# EAGLE schematic H38R01 (EAGLE 9.6.2)
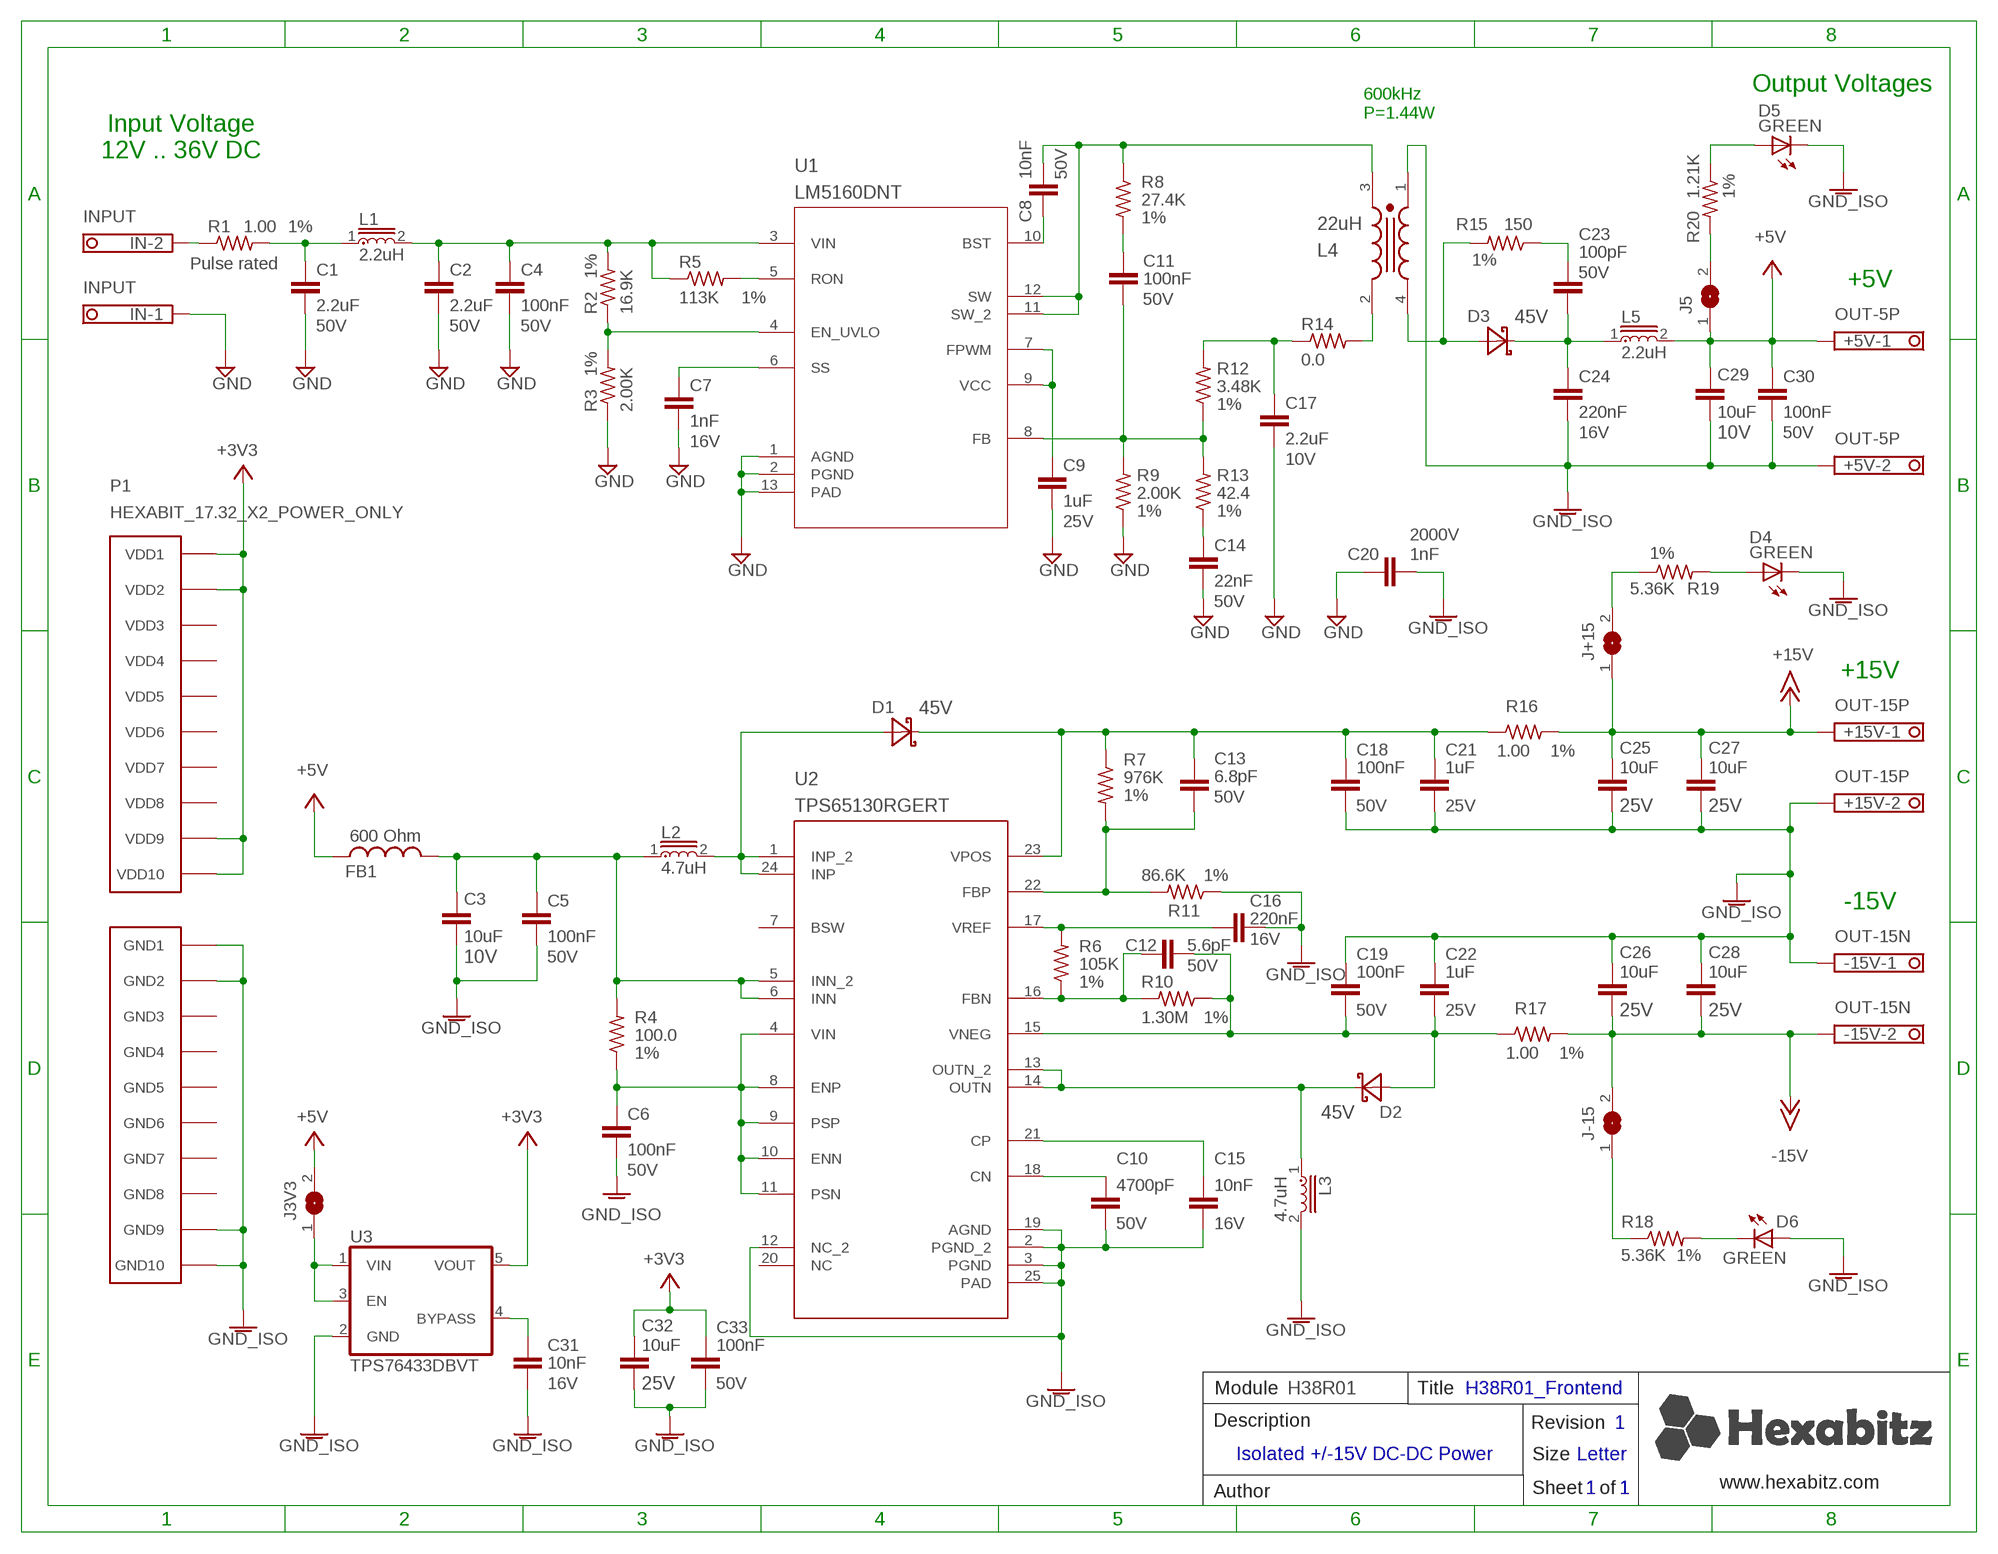
[diagram p0: schematic, sheet 1]

## Parts
+5V  OUT-5P  CON-PHOENIX-350_1751248  [CON-PHOENIX-350_1751248]
+15V  OUT-15P  CON-PHOENIX-350_1751248  [CON-PHOENIX-350_1751248]
-15V  OUT-15N  CON-PHOENIX-350_1751248  [CON-PHOENIX-350_1751248]
C1  2.2uF  C-1206  [C1206K]
C2  2.2uF  C-1206  [C1206K]
C3  10uF  C-0805  [C-0805]
C4  100nF  C-0603  [C-0603]
C5  100nF  C-0603  [C-0603]
C6  100nF  C-0603  [C-0603]
C7  1nF  C-0603  [C-0603]
C8  10nF  C-0603  [C-0603]
C9  1uF  C-0603  [C-0603]
C10  4700pF  C-0603  [C-0603]
C11  100nF  C-0603  [C-0603]
C12  5.6pF  C-0603  [C-0603]
C13  6.8pF  C-0603  [C-0603]
C14  22nF  C-0603  [C-0603]
C15  10nF  C-0603  [C-0603]
C16  220nF  C-0603  [C-0603]
C17  2.2uF  C-0603  [C-0603]
C18  100nF  C-0603  [C-0603]
C19  100nF  C-0603  [C-0603]
C20  1nF  C-1206  [C1206K]
C21  1uF  C-0603  [C-0603]
C22  1uF  C-0603  [C-0603]
C23  100pF  C-0603  [C-0603]
C24  220nF  C-0603  [C-0603]
C25  10uF  C-0805  [C-0805]
C26  10uF  C-0805  [C-0805]
C27  10uF  C-0805  [C-0805]
C28  10uF  C-0805  [C-0805]
C29  10uF  C-0805  [C-0805]
C30  100nF  C-0603  [C-0603]
C31  10nF  C-0603  [C-0603]
C32  10uF  C-0805  [C-0805]
C33  100nF  C-0603  [C-0603]
D1  DIOD-SOD-123  [SOD123]
D2  DIOD-SOD-123  [SOD123]
D3  DIOD-SOD-123  [SOD123]
D4  GREEN  VLMTG1300-GS08  [VLMS1300-GS08]
D5  GREEN  VLMTG1300-GS08  [VLMS1300-GS08]
D6  GREEN  VLMTG1300-GS08  [VLMS1300-GS08]
FB1  600 Ohm  FB-0603  [FB-0603]
IN  INPUT  CON-PHOENIX-350_1751248  [CON-PHOENIX-350_1751248]
J3V3  SJ  [SJ]
J5  SJ  [SJ]
J+15  SJ  [SJ]
J-15  SJ  [SJ]
L1  2.2uH  LQM18PN2R2MFHD  [C-0603]
L2  4.7uH  WUERTH_ELEKTRONIK_74404024100WUERTH_ELEKTRONIK_74404024100_0_0  [WUERTH_ELEKTRONIK_74404024100_0]
L3  4.7uH  WUERTH_ELEKTRONIK_74404024100WUERTH_ELEKTRONIK_74404024100_0_0  [WUERTH_ELEKTRONIK_74404024100_0]
L4  22uH  WUERTH_ELEKTRONIK_74489430220WUERTH_ELEKTRONIK_74489430220_0_0  [WUERTH_ELEKTRONIK_74489430220_0]
L5  2.2uH  LQM18PN2R2MFHD  [C-0603]
P1  HEXABIT_17.32_X2_POWER_ONLY  [HEXABIT_17.32_X2_POWER_ONLY]
R1  1.00  R-0603  [R-0603]
R2  16.9K  R-0603  [R-0603]
R3  2.00K  R-0603  [R-0603]
R4  100.0  R-0603  [R-0603]
R5  113K  R-0603  [R-0603]
R6  105K  R-0603  [R-0603]
R7  976K  R-0603  [R-0603]
R8  27.4K  R-0603  [R-0603]
R9  2.00K  R-0603  [R-0603]
R10  1.30M  R-0603  [R-0603]
R11  86.6K  R-0603  [R-0603]
R12  3.48K  R-0603  [R-0603]
R13  42.4  R-0603  [R-0603]
R14  0.0  R-0603  [R-0603]
R15  150  R-0603  [R-0603]
R16  1.00  R-0603  [R-0603]
R17  1.00  R-0603  [R-0603]
R18  5.36K  R-0603  [R-0603]
R19  5.36K  R-0603  [R-0603]
R20  1.21K  R-0603  [R-0603]
U1  LM5160DNT  [DNT0012B]
U2  TPS65130RGERT  [RGE0024B_NV]
U3  TPS76433DBVT  [SOT25]

## Nets
+3V3: C32.1 C33.1 P1.PAD_PU11(VDD1) P1.PAD_PU12(VDD2) P1.PAD_PU19(VDD9) P1.PAD_PU20(VDD10) U3.5(VOUT)
+5V: +5V.1 C29.1 C30.1 FB1.1 J3V3.2 J5.1 L5.2
+15V: +15V.1 C25.1 C27.1 J+15.1 R16.2
-15V: -15V.2 C26.2 C28.2 J-15.2 R17.2
GND: C1.2 C2.2 C4.2 C7.2 C9.2 C14.2 C17.2 C20.1 IN.1 R3.1 R9.1 U1.1(AGND) U1.2(PGND) U1.13(PAD)
IGND: +5V.2 +15V.2 -15V.1 C3.2 C5.2 C6.2 C10.2 C15.2 C16.2 C18.2 C19.1 C20.2 C21.2 C22.1 C24.2 C25.2 C26.1 C27.2 C28.1 C29.2 C30.2 C31.2 C32.2 C33.2 D4.C D5.C D6.A L3.2 L4.1 P1.PAD_PD11(GND1) P1.PAD_PD12(GND2) P1.PAD_PD19(GND9) P1.PAD_PD20(GND10) R11.1 U2.2(PGND_2) U2.3(PGND) U2.12(NC_2) U2.19(AGND) U2.25(PAD) U3.2(GND) ; supply symbol labelled GND_ISO
N$1: IN.2 R1.1
N$2: C1.1 L1.1 R1.2
N$3: C2.1 C4.1 L1.2 R2.2 R5.1 U1.3(VIN)
N$4: R5.2 U1.5(RON)
N$5: R2.1 R3.2 U1.4(EN_UVLO)
N$6: C7.1 U1.6(SS)
N$7: C8.2 L4.3 R8.1 U1.11(SW_2) U1.12(SW)
N$8: C8.1 U1.10(BST)
N$9: C9.1 U1.7(FPWM) U1.9(VCC)
N$10: C11.2 R9.2 R12.1 R13.2 U1.8(FB)
N$11: C11.1 R8.2
N$12: C17.1 R12.2 R14.1
N$13: L4.2 R14.2
N$14: C14.1 R13.1
N$15: C23.2 C24.1 D3.2(C) L5.1
N$16: D3.1(A) L4.4 R15.2
N$17: C23.1 R15.1
N$18: C3.1 C5.1 FB1.2 L2.1 R4.2 U2.5(INN_2) U2.6(INN)
N$19: J5.2 R20.2
N$20: D5.A R20.1
N$21: D1.1(A) L2.2 U2.1(INP_2) U2.24(INP)
N$22: C13.2 C18.1 C21.1 D1.2(C) R7.1 R16.1 U2.23(VPOS)
N$23: C6.1 R4.1 U2.4(VIN) U2.8(ENP) U2.9(PSP) U2.10(ENN) U2.11(PSN)
N$24: C10.1 U2.18(CN)
N$25: C15.1 U2.21(CP)
N$26: D2.2(C) L3.1 U2.13(OUTN_2) U2.14(OUTN)
N$27: C12.2 C19.2 C22.2 D2.1(A) R10.1 R17.1 U2.15(VNEG)
N$28: C12.1 R6.1 R10.2 U2.16(FBN)
N$29: C16.1 R6.2 U2.17(VREF)
N$30: C13.1 R7.2 R11.2 U2.22(FBP)
N$31: J+15.2 R19.1
N$32: D4.A R19.2
N$33: J-15.1 R18.1
N$34: D6.C R18.2
N$35: C31.1 U3.4(BYPASS)
N$36: J3V3.1 U3.1(VIN) U3.3(EN)
Unconnected: U2.7(BSW) U2.20(NC)

## Notes on the sheet
- Output Voltages
- 600kHz
  P=1.44W
- Input Voltage
  12V .. 36V DC
- Pulse rated
- +5V
- +15V
- -15V
- Module | H38R01 | Title | H38R01_Frontend
- Description | Revision | 1
- Isolated +/-15V DC-DC Power
- Size | Letter
- www.hexabitz.com
- Author | Sheet   of | 1 | 1
- C:/Users/Admin/Desktop/logodraft.bmp

## Power pins joined to a net without a drawn wire
GND3: P1.PAD_PD13(GND3)
GND4: P1.PAD_PD14(GND4)
GND5: P1.PAD_PD15(GND5)
GND6: P1.PAD_PD16(GND6)
GND7: P1.PAD_PD17(GND7)
GND8: P1.PAD_PD18(GND8)
VDD3: P1.PAD_PU13(VDD3)
VDD4: P1.PAD_PU14(VDD4)
VDD5: P1.PAD_PU15(VDD5)
VDD6: P1.PAD_PU16(VDD6)
VDD7: P1.PAD_PU17(VDD7)
VDD8: P1.PAD_PU18(VDD8)

## Library data of the parts
+5V +15V -15V IN = Hexabitz:CON-PHOENIX-350_1751248: 2pin Terminal Block; Printed Circuit; 10 A; 160 V; 3.5 mm; 2; 3.5 mm; 1.2 mm; M2; PA; MFN: Phoenix Contact; MPN: 1751251; OCTOPART_URL: https://octopart.com/1751251-phoenix+contact-36473?r=sp&s=9M0VWNoHTyq04j3qI6lQOQ; OC_FARNELL: unknown; OC_NEWARK: unknown
C1 C2 = Hexabitz:C-1206: Cap Tant Solid SMD 1206; CAPACITANCE: 2.2uF; MFN: Taiyo Yuden; MPN: UMK316B7225KD-T; OCTOPART_URL: https://octopart.com/umk316b7225kd-t-taiyo+yuden-22313261?r=sp&s=B2pE5EchQ-uXrqiEc-TSGg; VOLTAGE: 50V
C3 C29 = Hexabitz:C-0805: CAP CER 10% X7R 0805; CAPACITANCE: 10uF; MFN: Würth Elektronik; MPN: 885012207026; OCTOPART_URL: https://octopart.com/885012207026-w%C3%BCrth+elektronik-65419800?r=sp&s=PJ8-ZxRrRL-RXf1D2e7V7w; TOLERANCE: 10%; VOLTAGE_RATING: 10V
C4-C6 C11 C18 C19 C30 C33 = Hexabitz:C-0603: CAP CER 10% X7R 0603; CAPACITANCE: 100nF; MFN: TDK; MPN: C1608X7R1H104K; OCTOPART_URL: https://octopart.com/c1608x7r1h104k080aa-tdk-25947665?r=sp&s=vJ3_28x5RGekN18MBHqpKw; TOLERANCE: 10%; VOLTAGE_RATING: 50V
C7 = Hexabitz:C-0603: CAP CER 10% X7R 0603; CAPACITANCE: 1nF; MFN: Würth Elektronik; MPN: 885012206034; OCTOPART_URL: https://octopart.com/885012206034-w%C3%BCrth+elektronik-53914743?r=sp&s=3y92xzxLSKK6IudBxcGU8w; TOLERANCE: 10%; VOLTAGE_RATING: 16V
C8 = Hexabitz:C-0603: CAP CER 10% X7R 0603; CAPACITANCE: 10nF; MFN: KEMET; MPN: C0603C103J5RACTU; OCTOPART_URL: https://octopart.com/c0603c103j5ractu-kemet-91371?r=sp&s=Kyc2xDn-SuWGmNLJldLSIQ; TOLERANCE: 10%; VOLTAGE_RATING: 50V
C9 C21 C22 = Hexabitz:C-0603: CAP CER 10% X7R 0603; CAPACITANCE: 1uF; MFN: Taiyo Yuden; MPN: TMK107B7105KA-T; OCTOPART_URL: https://octopart.com/tmk107b7105ka-t-taiyo+yuden-20363789?r=sp&s=C0MvDSixSxq0oU7K_M5ppQ; TOLERANCE: 10%; VOLTAGE_RATING: 25V
C10 = Hexabitz:C-0603: CAP CER 10% X7R 0603; CAPACITANCE: 4700pF; MFN: Würth Elektronik; MPN: 885012206087; OCTOPART_URL: https://octopart.com/885012206087-w%C3%BCrth+elektronik-53914796?r=sp&s=1K2nhhCgSUq-KN0bvB69Uw; TOLERANCE: 10%; VOLTAGE_RATING: 50V
C12 = Hexabitz:C-0603: CAP CER 10% X7R 0603; CAPACITANCE: 5.6pF; MFN: TDK; MPN: 06035A5R6CAT2A; OCTOPART_URL: https://octopart.com/06035a5r6cat2a-avx-194782?r=sp&s=arSRmqwrS2KePu_erVaGmg; TOLERANCE: 5%; VOLTAGE_RATING: 50V
C13 = Hexabitz:C-0603: CAP CER 10% X7R 0603; CAPACITANCE: 6.8pF; MFN: AVX; MPN: 06035A6R8CAT2A; OCTOPART_URL: https://octopart.com/06035a6r8cat2a-avx-194783?r=sp&s=5-5NBtM6RDWLTSW9K30eVg; TOLERANCE: 10%; VOLTAGE_RATING: 50V
C14 = Hexabitz:C-0603: CAP CER 10% X7R 0603; CAPACITANCE: 22nF; MFN: Murata; MPN: GRM188R71H223KA01D; OCTOPART_URL: https://octopart.com/grm188r71h223ka01d-murata-196232?r=sp&s=t23e6pi9S5yo9EHFMT_EKg; TOLERANCE: 10%; VOLTAGE_RATING: 50V
C15 C31 = Hexabitz:C-0603: CAP CER 10% X7R 0603; CAPACITANCE: 10nF; MFN: Würth Elektronik; MPN: 885012206040; OCTOPART_URL: https://octopart.com/885012206040-w%C3%BCrth+elektronik-53914749?r=sp&s=G3_ezLbARM2-FohtMFECqg; TOLERANCE: 10%; VOLTAGE_RATING: 16V
C16 C24 = Hexabitz:C-0603: CAP CER 10% X7R 0603; CAPACITANCE: 220nF; MFN: Würth Elektronik; MPN: 885012206048; OCTOPART_URL: https://octopart.com/885012206048-w%C3%BCrth+elektronik-53914757?r=sp&s=r2jVh1M7TTWSNtdrsMd35A; TOLERANCE: 10%; VOLTAGE_RATING: 16V
C17 = Hexabitz:C-0603: CAP CER 10% X7R 0603; CAPACITANCE: 2.2uF; MFN: Murata; MPN: GRM188R71A225KE15D; OCTOPART_URL: https://octopart.com/grm188r71a225ke15d-murata-197889?r=sp&s=UhC5vs9xSQGkDEPPXrg6Ig; TOLERANCE: 10%; VOLTAGE_RATING: 10V
C20 = Hexabitz:C-1206: Cap Tant Solid SMD 1206; CAPACITANCE: 1nF; MFN: Johanson; MPN: 202R18W102KV4E; OCTOPART_URL: https://octopart.com/202r18w102kv4e-johanson-2172376?r=sp&s=IMqDAiaaSSy_LnEOeR4maQ; VOLTAGE: 2000V
C23 = Hexabitz:C-0603: CAP CER 10% X7R 0603; CAPACITANCE: 100pF; MFN: KEMET; MPN: C0603C101J5GACTU; OCTOPART_URL: https://octopart.com/c0603c101j5gactu-kemet-100052?r=sp&s=G9Wafbc2Rs-t41DcITu08w; TOLERANCE: 5%; VOLTAGE_RATING: 50V
C25-C28 C32 = Hexabitz:C-0805: CAP CER 10% X7R 0805; CAPACITANCE: 10uF; MFN: Murata; MPN: GRM21BC71E106KE11L; OCTOPART_URL: https://octopart.com/grm21bc71e106ke11l-murata-51454492?r=sp&s=2Vde2RpCRyqy5YYMvYke3Q; TOLERANCE: 10%; VOLTAGE_RATING: 25V
D1-D3 = Hexabitz:DIOD-SOD-123: 1.0 A Surface Mount Schottky Barrier Rectifier, 40 V, -65 to 125 degC, 2-Pin SOD-123 Package, RoHS, Tape and Reel; CURRENT: 2A; MFN: ON Semiconductor; MPN: NTS245SFT1G; OCTOPART_URL: https://octopart.com/nts245sft1g-on+semiconductor-53638116?r=sp&s=Zo8Z59f0QcynsgZ2PtBRwg; VOLTAGE_RATING_DC: 45V
D4-D6 = Hexabitz:VLMTG1300-GS08: LED Uni-Color Green 530nm 2-Pin Chip 0603(1608Metric) T/R; MFN: Vishay; MPN: VLMTG1300-GS08; OCTOPART_URL: https://octopart.com/vlmtg1300-gs08-vishay-21709202
FB1 = Hexabitz:FB-0603: Ferrite Beads Multi-Layer 0603; MFN: Murata; MPN: BLM18KG601SN1D; OCTOPART_URL: https://octopart.com/blm18kg601sn1d-murata-12276433?r=sp&s=hc41AUOpRWisdZqqWWZOxA
J3V3 J5 J+15 J-15 = jumper:SJ: SMD solder JUMPER
L1 L5 = Hexabitz:LQM18PN2R2MFHD: Inductor Power Chip Shielded Multi-Layer 2.2uH 20% 1MHz Ferrite 0.7A 0.475Ohm DCR 0603 T/R; MFN: Murata; MPN: LQM18PN2R2MFHD; OCTOPART_URL: https://octopart.com/lqm18pn2r2mfhd-murata-46921411?r=sp&s=Row_twtqSIqtu2tUWXcF8g#
L2 L3 = Hexabitz:WUERTH_ELEKTRONIK_74404024100: Inductor, Wirewound, Ferrite, 10 μH, 0.47 A, 0.435 ohm, SMD; CIIVA_IDS: 19365520; COMPONENT_LINK_1_DESCRIPTION: Manufacturer URL; COMPONENT_LINK_1_URL: http://www.we-online.com; DATASHEET: http://katalog.we-online.de/pbs/datasheet/74404024100.pdf; FOOTPRINT_VARIANT_NAME_0: Manufacturer Recommended; IMPORTED: yes; IMPORTED_FROM: vault; IMPORT_TS: 1521847971; INDUCTANCE: 4.7μH; MF: Wuerth Elektronik; MFN: Wuerth Elektronik; MPN: 74404024047; OCTOPART_URL: https://octopart.com/74404024047-w%C3%BCrth+elektronik-46948230?r=sp; PACKAGE: WE-LQS 252012; PREFIX: L; RELEASE_DATE: 1421136684; VALUE: 10uH; VAULT_GUID: 14C676CA-5921-489C-B22D-D02530F94C47; VAULT_REVISION: 1C5BE5AF-1DED-48F4-87F1-C018B46CE48A
L4 = Hexabitz:WUERTH_ELEKTRONIK_74489430220: Coupled inductor, 22 μH, 1.1 A, 0.48 ohm, SMD; CIIVA_IDS: 906613; COMPONENT_LINK_1_DESCRIPTION: Manufacturer URL; COMPONENT_LINK_1_URL: http://www.we-online.com; DATASHEET: http://katalog.we-online.de/pbs/datasheet/74489430220.pdf; FOOTPRINT_VARIANT_NAME_0: Manufacturer Recommended; IMPORTED: yes; IMPORTED_FROM: vault; IMPORT_TS: 1521847487; INDUCTANCE: 22.0 ÂμH; MF: Wuerth Elektronik; MFN: Wuerth Elektronik; MPN: 74489430220; OCTOPART_URL: https://octopart.com/74489430220-w%C3%BCrth+elektronik-19122490?r=sp&s=sZgvZhVdRiOvXPP3ZHNQng#; PACKAGE: WE-TDC 8018; PREFIX: L; RELEASE_DATE: 1421213019; VAULT_GUID: DC7281E7-2FA0-48B8-8A08-9B1522AF1AC9; VAULT_REVISION: AD34EA21-00F0-458B-A44F-F680A14C5CDA
P1 = hexabitz_connectors:HEXABIT_?_X2_POWER_ONLY: Hexabitz Double Hexagon Power-Only Module Connector Hexagon side length = 17.32mm.
R1 = Hexabitz:R-0603: Thick Film Resistors - SMD 0603; MFN: Vishay; MPN: RCS06031R00FKEA; OCTOPART_URL: https://octopart.com/rcs06031r00fkea-vishay-75198106?r=sp; RESISTANCE: 1.00; TOLERANCE: 1%
R2 = Hexabitz:R-0603: Thick Film Resistors - SMD 0603; MFN: Vishay; MPN: CRCW060316K9FKEA; OCTOPART_URL: https://octopart.com/crcw060316k9fkea-vishay-39809405?r=sp&s=gpyoC5sESS275Bx1L_ovfA; RESISTANCE: 16.9K; TOLERANCE: 1%
R3 R9 = Hexabitz:R-0603: Thick Film Resistors - SMD 0603; MFN: Vishay; MPN: CRCW06032K00FKEA; OCTOPART_URL: https://octopart.com/crcw06032k00fkea-vishay-39455515?r=sp&s=oLMBsKnqSyiGxb37P4YGRQ; RESISTANCE: 2.00k; TOLERANCE: 1%
R4 = Hexabitz:R-0603: Thick Film Resistors - SMD 0603; MFN: Vishay; MPN: CRCW0603100RFKEA; OCTOPART_URL: https://octopart.com/crcw0603100rfkea-vishay-39454046?r=sp&s=ZCLXy-8WTNaYdj0NMUzO0A; RESISTANCE: 100.0; TOLERANCE: 1%
R5 = Hexabitz:R-0603: Thick Film Resistors - SMD 0603; MFN: Vishay; MPN: CRCW0603113KFKEA; OCTOPART_URL: https://octopart.com/crcw0603113kfkea-vishay-39817257?r=sp&s=CTaWAi24RJSm7_6d5HDAcw; RESISTANCE: 113K; TOLERANCE: 1%
R6 = Hexabitz:R-0603: Thick Film Resistors - SMD 0603; MFN: Vishay; MPN: CRCW0603105KFKEA; OCTOPART_URL: https://octopart.com/crcw0603105kfkea-vishay-39783419?r=sp&s=m57LqOW9SZi8auMTWgZAuA; RESISTANCE: 105K; TOLERANCE: 1%
R7 = Hexabitz:R-0603: Thick Film Resistors - SMD 0603; MFN: Vishay; MPN: CRCW0603976KFKEA; OCTOPART_URL: https://octopart.com/crcw0603976kfkea-vishay-39847458?r=sp&s=cUxC9lyxRzee74EppCoygA; RESISTANCE: 976K; TOLERANCE: 1%
R8 = Hexabitz:R-0603: Thick Film Resistors - SMD 0603; MFN: Vishay; MPN: CRCW060327K4FKEA; OCTOPART_URL: https://octopart.com/crcw060327k4fkea-vishay-40950191?r=sp&s=-sh_flwyTnabpVfO2SO3MQ; RESISTANCE: 27.4K; TOLERANCE: 1%
R10 = Hexabitz:R-0603: Thick Film Resistors - SMD 0603; MFN: Vishay; MPN: CRCW06031M30FKEA; OCTOPART_URL: https://octopart.com/crcw06031m30fkea-vishay-39601140?r=sp&s=IFmbrVO2QdmVcSmXO7E1AA; RESISTANCE: 1.30M; TOLERANCE: 1%
R11 = Hexabitz:R-0603: Thick Film Resistors - SMD 0603; MFN: Vishay; MPN: CRCW060386K6FKEA; OCTOPART_URL: https://octopart.com/crcw060386k6fkea-vishay-39809057?r=sp&s=kiKKot43Sa6nkjOnoApb7Q; RESISTANCE: 86.6K; TOLERANCE: 1%
R12 = Hexabitz:R-0603: Thick Film Resistors - SMD 0603; MFN: Vishay; MPN: CRCW06033K48FKEA; OCTOPART_URL: https://octopart.com/crcw06033k48fkea-vishay-39806638?r=sp&s=N5g7S2AyTDmMWBX-_wGc6Q; RESISTANCE: 3.48K; TOLERANCE: 1%
R13 = Hexabitz:R-0603: Thick Film Resistors - SMD 0603; MFN: Vishay; MPN: CRCW060342R2FKEA; OCTOPART_URL: https://octopart.com/crcw060342r2fkea-vishay-39808977?r=sp&s=-XoBdwS-TmODK1i1WGs3Gw; RESISTANCE: 42.2R; TOLERANCE: 1%
R14 = Hexabitz:R-0603: Thick Film Resistors - SMD 0603; MFN: Panasonic; MPN: ERJ-3GEY0R00V; OCTOPART_URL: https://octopart.com/erj-3gey0r00v-panasonic-55389238?r=sp&s=8dmrTZyCS32IAujh55Hh-g; RESISTANCE: 0.0R; TOLERANCE: 5%
R15 = Hexabitz:R-0603: Thick Film Resistors - SMD 0603; MFN: Vishay; MPN: CRCW0603150RFKEA; OCTOPART_URL: https://octopart.com/crcw0603150rfkea-vishay-39455211?r=sp&s=fhZ4fTqDSW-fVK_X4mehlA; RESISTANCE: 150R; TOLERANCE: 1%
R16 R17 = Hexabitz:R-0603: Thick Film Resistors - SMD 0603; MFN: Vishay-Dale; MPN: CRCW06031R00FKEA; OCTOPART_URL: https://octopart.com/crcw06031r00fkea-vishay-39713722?r=sp&s=biXSlGylTBiwPOCcABx_kA; RESISTANCE: 1.00; TOLERANCE: 1%
R18 R19 = Hexabitz:R-0603: Thick Film Resistors - SMD 0603; MFN: Vishay; MPN: CRCW06035K36FKEA; OCTOPART_URL: https://octopart.com/crcw06035k36fkea-vishay-39850082?r=sp&s=UzQdyXKeQlK-zUZHNwTiSQ; RESISTANCE: 5.36K; TOLERANCE: 1%
R20 = Hexabitz:R-0603: Thick Film Resistors - SMD 0603; MFN: Vishay; MPN: CRCW06031K21FKEA; OCTOPART_URL: https://octopart.com/crcw06031k21fkea-vishay-39455541?r=sp&s=DmmN7huOS0CziwVau3vt0g; RESISTANCE: 1.21K; TOLERANCE: 1%
U1 = Hexabitz:LM5160DNT: LM5160 wide input 65V, 2A synchronous buck/Fly-Buck™ converter 12-WSON -40 to 125; COMPTYPE: IC; MANUFACTURER: Texas Instruments; MFN: Texas Instruments; MOUNTTYPE: SMT; MPN: LM5160DNT; OCTOPART_URL: https://octopart.com/lm5160dntt-texas+instruments-51761725?r=sp&s=sYhYnlaHQIStkk-s71hgUg; PACKAGEREFERENCE: DNT0012B; PARTNUMBER: LM5160DNT; PIN_COUNT: 13; REFDES: RefDes; ROHS: Y; TYPE: TYPE
U2 = Hexabitz:TPS65130RGER: Split-Rail Converter with Dual, Positive and Negative Outputs (300mA typ) 24-VQFN -40 to 85; ALTERNATE_PARTNUMBER: TPS65130RGET; APPLICATION_BUILDNUMBER: *; COMPTYPE: IC; MANUFACTURER: Texas Instruments; MFN: Texas Instruments; MOUNTTYPE: SMT; MPN: TPS65130RGET; OCTOPART_URL: https://octopart.com/tps65130rget-texas+instruments-7102173?r=sp&s=1oanP9AbQhOs522rlI3BXw; PACKAGEREFERENCE: RGE0024B; PARTNUMBER: TPS65130RGER; PIN_COUNT: 25; REFDES: RefDes; ROHS: Y; TYPE: TYPE
U3 = Hexabitz:TPS764: 150mA Low Noise LDO Voltage Regulator with Enable; MFN: Texas Instruments; MPN: TPS76433DBVT; OCTOPART_URL: https://octopart.com/tps76433dbvt-texas+instruments-69873?r=sp&s=0aHKKhMLSUCTmmqJkhwwIQ